# Altium schematic sheet Hardwiring.SchDoc
size 594 x 420 mm; Address1: Address1; Address2: Address2; Address3: Address3; Address4: Address4; DocumentNumber: *Э3; SheetNumber: 10; SheetTotal: 12; DocumentType: Схема электрическая *
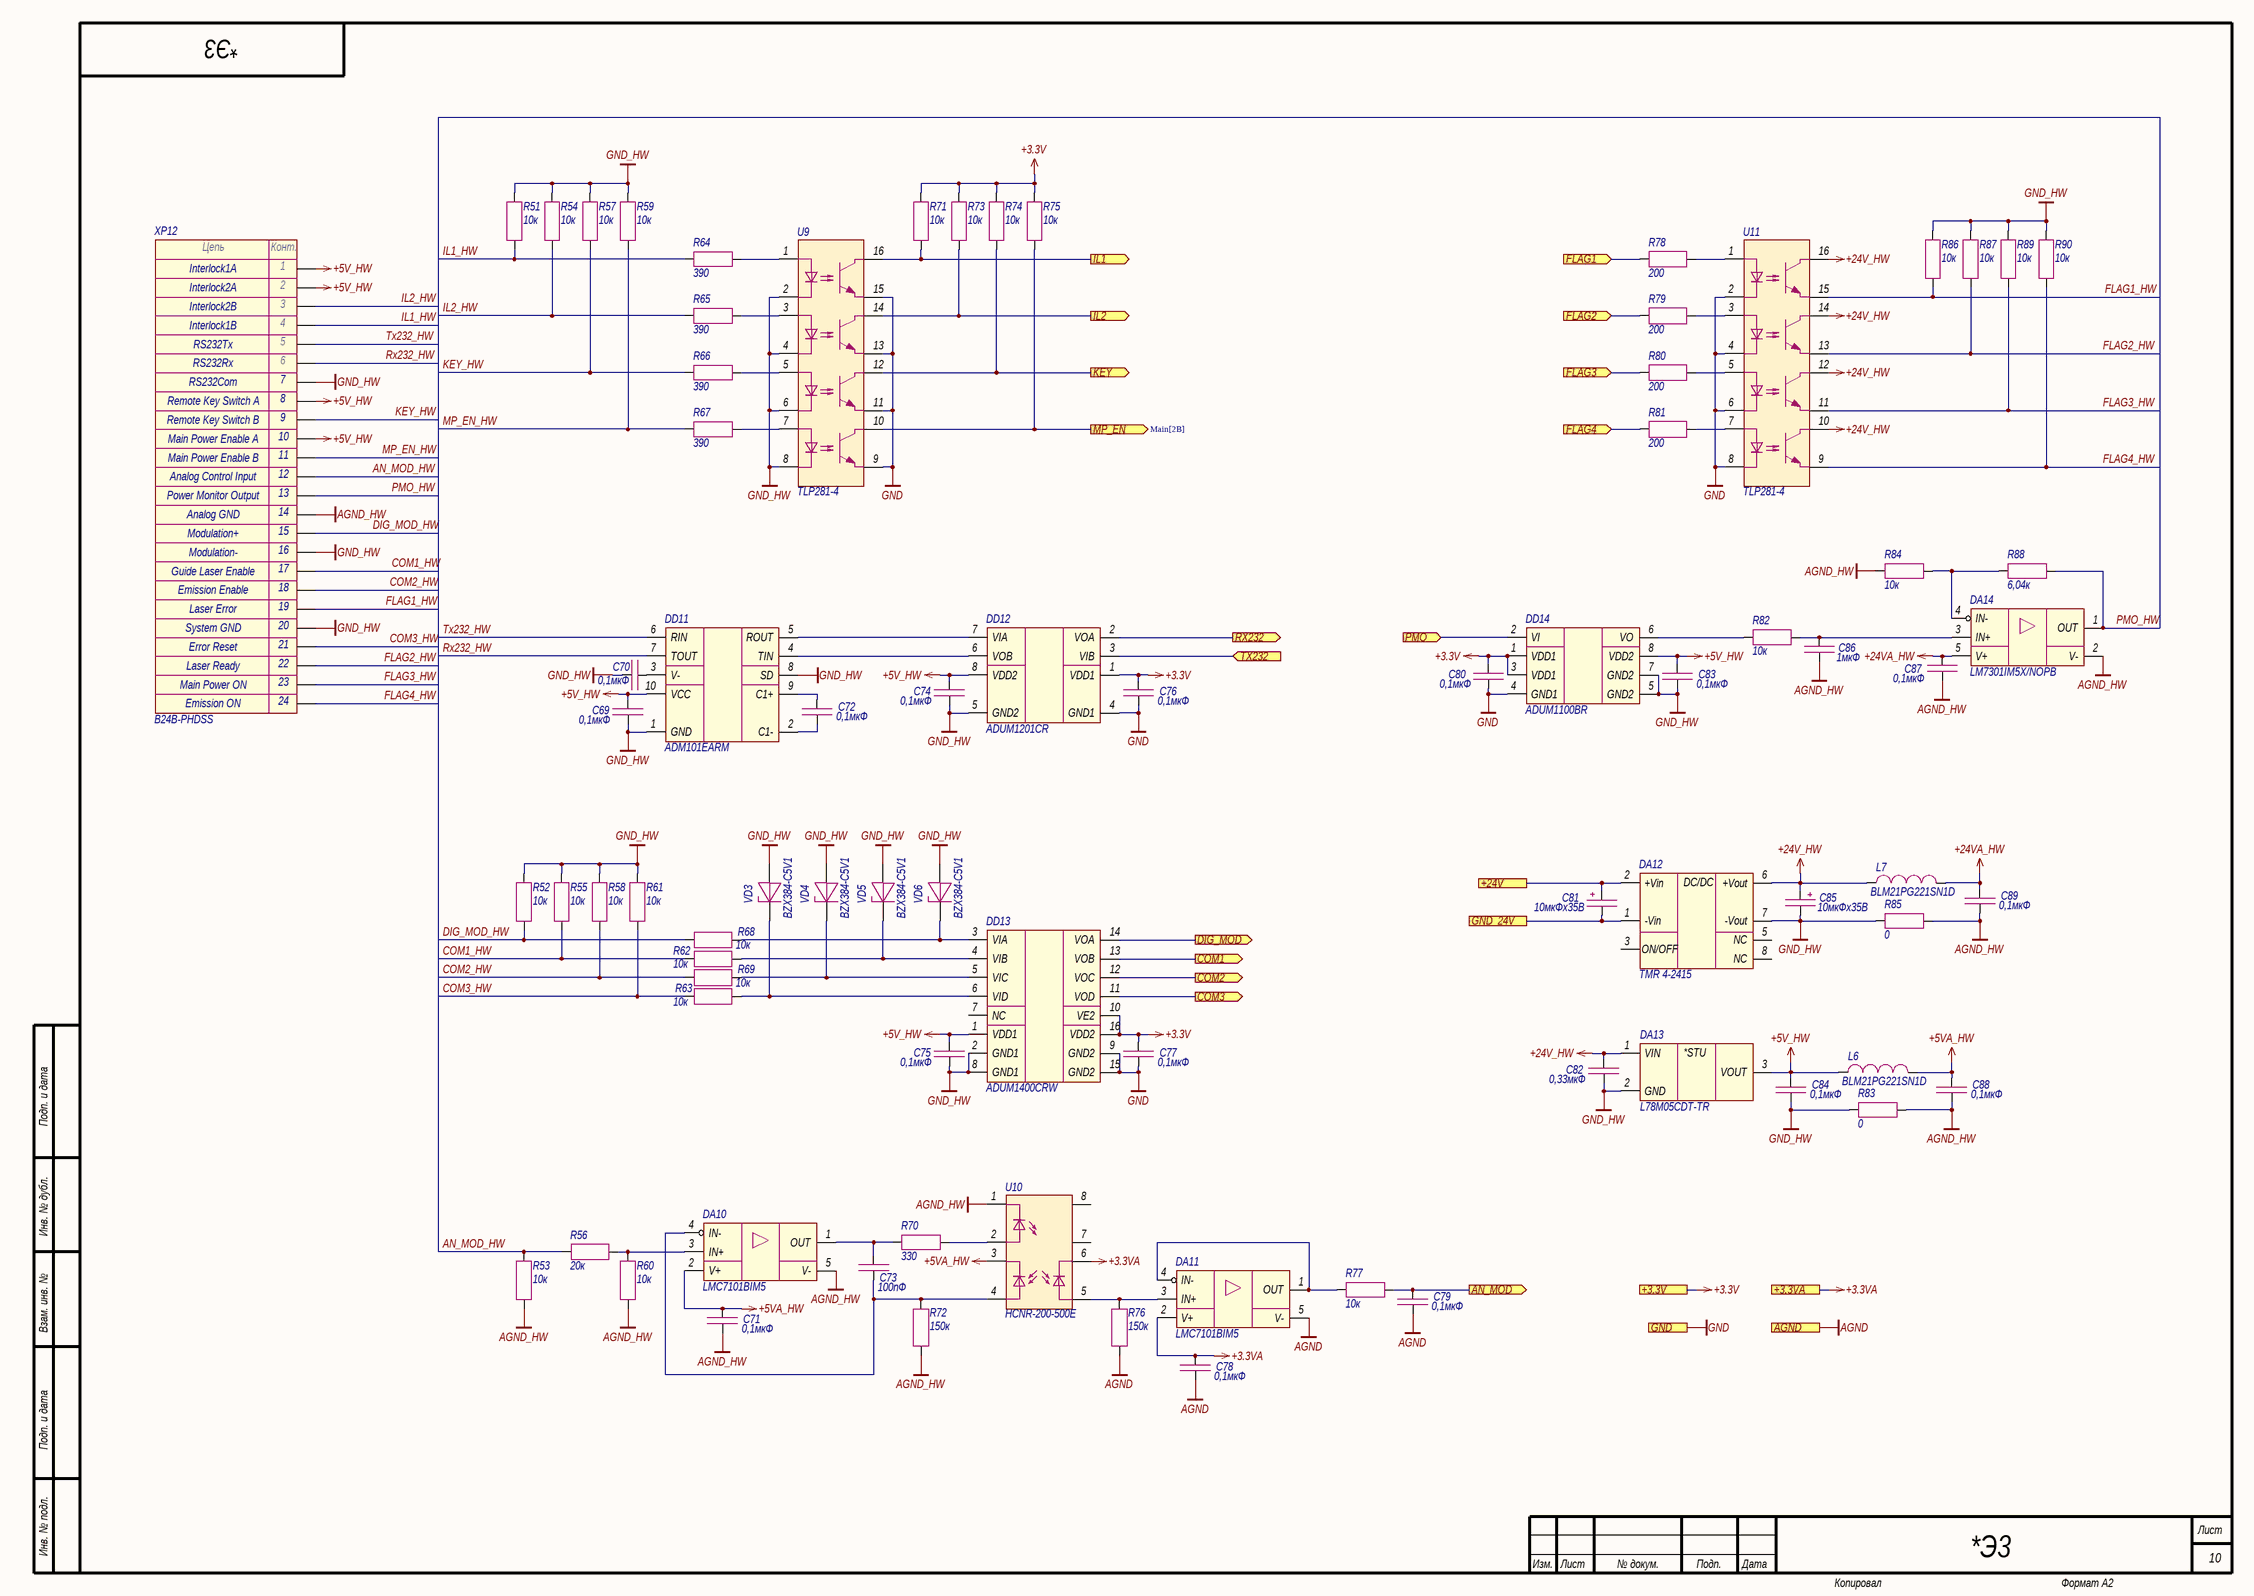
[diagram p0: Hardwiring.SchDoc]

## Parts
C69  0,1мкФ  [CAP_0603]
C70  0,1мкФ  [CAP_0603]
C71  0,1мкФ  [CAP_0603]
C72  0,1мкФ  [CAP_0603]
C73  100пФ  [CAP_0603]
C74  0,1мкФ  [CAP_0603]
C75  0,1мкФ  [CAP_0603]
C76  0,1мкФ  [CAP_0603]
C77  0,1мкФ  [CAP_0603]
C78  0,1мкФ  [CAP_0603]
C79  0,1мкФ  [CAP_0603]
C80  0,1мкФ  [CAP_0603]
C81  10мкФх35B  [CAP_C]
C82  0,33мкФ  [CAP_0805]
C83  0,1мкФ  [CAP_0603]
C84  0,1мкФ  [CAP_0603]
C85  10мкФх35B  [CAP_C]
C86  1мкФ  [CAP_0603]
C87  0,1мкФ  [CAP_0603]
C88  0,1мкФ  [CAP_0603]
C89  0,1мкФ  [CAP_0603]
DA10  LMC7101BIM5  [SOT-23-5]
DA11  LMC7101BIM5  [SOT-23-5]
DA12  TMR 4-2415  [TMR4 (SIP-8)]
DA13  L78M05CDT-TR  [TO-252]
DA14  LM7301IM5X/NOPB  [SOT-23-5]
DD11  ADM101EARM  [MSOP-10]
DD12  ADUM1201CR  [SOIC-8]
DD13  ADUM1400CRW  [SOIC-16W]
DD14  ADUM1100BR  [SOIC-8]
L6  BLM21PG221SN1D  [IND_0805]
L7  BLM21PG221SN1D  [IND_0805]
R51  10к  [RES_0603]
R52  10к  [RES_0603]
R53  10к  [RES_0603]
R54  10к  [RES_0603]
R55  10к  [RES_0603]
R56  20к  [RES_0603]
R57  10к  [RES_0603]
R58  10к  [RES_0603]
R59  10к  [RES_0603]
R60  10к  [RES_0603]
R61  10к  [RES_0603]
R62  10к  [RES_0603]
R63  10к  [RES_0603]
R64  390  [RES_0603]
R65  390  [RES_0603]
R66  390  [RES_0603]
R67  390  [RES_0603]
R68  10к  [RES_0603]
R69  10к  [RES_0603]
R70  330  [RES_0603]
R71  10к  [RES_0603]
R72  150к  [RES_0603]
R73  10к  [RES_0603]
R74  10к  [RES_0603]
R75  10к  [RES_0603]
R76  150к  [RES_0603]
R77  10к  [RES_0603]
R78  200  [RES_0603]
R79  200  [RES_0603]
R80  200  [RES_0603]
R81  200  [RES_0603]
R82  10к  [RES_0603]
R83  0  [RES_0805]
R84  10к  [RES_0603]
R85  0  [RES_0805]
R86  10к  [RES_0603]
R87  10к  [RES_0603]
R88  6,04к  [RES_0603]
R89  10к  [RES_0603]
R90  10к  [RES_0603]
U9  TLP281-4  [SOP-16]
U10  HCNR-200-500E  [HCNR200]
U11  TLP281-4  [SOP-16]
VD3  BZX384-C5V1  [SOD-323]
VD4  BZX384-C5V1  [SOD-323]
VD5  BZX384-C5V1  [SOD-323]
VD6  BZX384-C5V1  [SOD-323]
XP12  B24B-PHDSS  [B24B-PHDSS]

## Ports
+3.3V (see Main[3B], Bus[1D], Button[1D], Ethernet[3D], Fiber_interlock[2C], Flow_sensor[2C]), +3.3VA (see Main[3B], Thermistor[2C]), +24V (see Main[3B], Bus[1D], Button[1C], Column[1C], Flow_sensor[2C], Indication[1C]), AGND (see Main[3B], Photodiode[1C], Thermistor[2C]), AN_MOD (out, see Main[2B]), COM1 (out, see Main[2B]), COM2 (out, see Main[2B]), COM3 (out, see Main[2B]), DIG_MOD (out, see Main[2B]), FLAG1 (in, see Main[3B]), FLAG2 (in, see Main[3B]), FLAG3 (in, see Main[3B]), FLAG4 (in, see Main[3B]), GND (see Main[3B], Bus[1D], Button[1D], Column[1C], Ethernet[3D], Fiber_interlock[2C], Flow_sensor[2C], Guide_laser[1C], Indication[1C]), GND_24V (see Main[3C], Bus[1D], Button[1D], Column[1C], Flow_sensor[2C], Indication[1C]), IL1 (out, see Main[2B]), IL2 (out, see Main[2B]), KEY (out, see Main[2B]), MP_EN (out, see Main[2B]), PMO (in, see Main[3B]), RX232 (out, see Main[2B]), TX232 (in, see Main[2C])

## Nets
+3.3V: C76.1 C77.1 C80.1 DD12.1(VDD1) DD13.10(VE2) DD13.16(VDD2) DD14.1(VDD1) DD14.3(VDD1) R71.1 R73.1 R74.1 R75.1 ; port +3.3V
+3.3VA: C78.1 DA11.2(V+) U10.6 ; port +3.3VA
+5V_HW: C69.1 C74.1 C75.1 C83.1 C84.1 DA13.3(VOUT) DD11.10(VCC) DD12.8(VDD2) DD13.1(VDD1) DD14.8(VDD2) L6.1 XP12.1 XP12.2 XP12.8 XP12.10
+5VA_HW: C71.1 C88.1 DA10.2(V+) L6.2 U10.3
+24V_HW: C82.2 C85.1 DA12.6(+Vout) DA13.1(VIN) L7.1 U11.10 U11.12 U11.14 U11.16
+24VA_HW: C87.1 C89.1 DA14.5(V+) L7.2
AGND: C78.2 C79.2 DA11.5(V-) R76.2 ; port AGND
AGND_HW: C71.2 C86.2 C87.2 C88.2 C89.2 DA10.5(V-) DA14.2(V-) R53.2 R60.2 R72.2 R83.2 R84.1 R85.2 U10.1 XP12.14
GND: C76.2 C77.2 C80.2 DD12.4(GND1) DD13.9(GND2) DD13.15(GND2) DD14.4(GND1) U9.9 U9.11 U9.13 U9.15 U11.2 U11.4 U11.6 U11.8 ; port GND
GND_HW: C69.2 C70.2 C74.2 C75.2 C82.1 C83.2 C84.2 C85.2 DA12.7(-Vout) DA13.2(GND) DD11.1(GND) DD11.8(SD) DD12.5(GND2) DD13.2(GND1) DD13.8(GND1) DD14.5(GND2) DD14.7(GND2) R51.1 R52.1 R54.1 R55.1 R57.1 R58.1 R59.1 R61.1 R83.1 R85.1 R86.1 R87.1 R89.1 R90.1 U9.2 U9.4 U9.6 U9.8 VD3.2(A) VD4.2(A) VD5.2(A) VD6.2(A) XP12.7 XP12.16 XP12.20
+24V: C81.1 DA12.2(+Vin) ; port +24V
AN_MOD: C79.1 R77.2 ; port AN_MOD
AN_MOD_HW: R53.1 R56.1 XP12.12
COM1: DD13.13(VOB) ; port COM1
COM1_HW: R55.2 R62.1 XP12.17
COM2: DD13.12(VOC) ; port COM2
COM2_HW: R58.2 R69.1 XP12.18
COM3: DD13.11(VOD) ; port COM3
COM3_HW: R61.2 R63.1 XP12.21
DIG_MOD: DD13.14(VOA) ; port DIG_MOD
DIG_MOD_HW: R52.2 R68.1 XP12.15
FLAG1: R78.2 ; port FLAG1
FLAG1_HW: R86.2 U11.15 XP12.19
FLAG2: R79.2 ; port FLAG2
FLAG2_HW: R87.2 U11.13 XP12.22
FLAG3: R80.2 ; port FLAG3
FLAG3_HW: R89.2 U11.11 XP12.23
FLAG4: R81.2 ; port FLAG4
FLAG4_HW: R90.2 U11.9 XP12.24
GND_24V: C81.2 DA12.1(-Vin) ; port GND_24V
IL1: R71.2 U9.16 ; port IL1
IL1_HW: R51.2 R64.1 XP12.4
IL2: R73.2 U9.14 ; port IL2
IL2_HW: R54.2 R65.1 XP12.3
KEY: R74.2 U9.12 ; port KEY
KEY_HW: R57.2 R66.1 XP12.9
MP_EN: R75.2 U9.10 ; port MP_EN
MP_EN_HW: R59.2 R67.1 XP12.11
PMO: DD14.2(VI) ; port PMO
PMO_HW: DA14.1(OUT) R88.2 XP12.13
RX232: DD12.2(VOA) ; port RX232
Rx232_HW: DD11.7(TOUT) XP12.6
TX232: DD12.3(VIB) ; port TX232
Tx232_HW: DD11.6(RIN) XP12.5
NetC70_1: C70.1 DD11.3(V-)
NetC72_1: C72.1 DD11.9(C1+)
NetC72_2: C72.2 DD11.2(C1-)
NetC73_1: C73.1 DA10.1(OUT) R70.1
NetC73_2: C73.2 DA10.4(IN-) R72.1 U10.4
NetC86_1: C86.1 DA14.3(IN+) R82.2
NetDA10_3: DA10.3(IN+) R56.2 R60.1
NetDA11_1: DA11.1(OUT) DA11.4(IN-) R77.1
NetDA11_3: DA11.3(IN+) R76.1 U10.5
NetDA14_4: DA14.4(IN-) R84.2 R88.1
NetDD11_4: DD11.4(TIN) DD12.6(VOB)
NetDD11_5: DD11.5(ROUT) DD12.7(VIA)
NetDD13_3: DD13.3(VIA) R68.2 VD6.1(K)
NetDD13_4: DD13.4(VIB) R62.2 VD5.1(K)
NetDD13_5: DD13.5(VIC) R69.2 VD4.1(K)
NetDD13_6: DD13.6(VID) R63.2 VD3.1(K)
NetDD14_6: DD14.6(VO) R82.1
NetR64_2: R64.2 U9.1
NetR65_2: R65.2 U9.3
NetR66_2: R66.2 U9.5
NetR67_2: R67.2 U9.7
NetR70_2: R70.2 U10.2
NetR78_1: R78.1 U11.1
NetR79_1: R79.1 U11.3
NetR80_1: R80.1 U11.5
NetR81_1: R81.1 U11.7

Not connected (* = marked no-connect by the designer): DA12 3(ON/OFF) 5(NC) 8(NC); DD13 7(NC); U10 7 8

## Notes on the sheet
- Interlock1A
- Interlock2A
- Interlock2B
- Interlock1B
- RS232Tx
- RS232Rx
- RS232Com
- (near XP12) Remote Key Switch A
- (near XP12) Remote Key Switch B
- (near XP12) Main Power Enable A
- (near XP12) Main Power Enable B
- (near XP12) Analog Control Input
- (near XP12) Power Monitor Output
- Analog GND
- Modulation+
- Modulation-
- (near XP12) Guide Laser Enable
- (near XP12) Emission Enable
- System GND
- Error Reset
- Laser Error
- Main Power ON
- Emission ON
- Laser Ready
- Подп. и дата
- Инв. № дубл.
- Взам. инв. №
- Инв. № подл.
- Изм.
- Лист
- № докум.
- Подп.
- Дата
- Копировал
- Формат А2
- (in symbol Connector-24) Цепь; Конт.
- (in symbol L78M) *STU
- (in symbol TMR4) DC/DC

## Library data of the parts
C69-C72 C74-C80 C83 C84 C87-C89 = Capacitor: Manufacturer: Murata; Model: GRM188R71H104KA93D; Value: 0,1мкФ; Document: *
C73 = Capacitor: Manufacturer: Murata; Model: GRM1885C1H101JA01D; Value: 100пФ; Document: *
C81 C85 = Capacitor_Polar: Model: TECAP, 10 мкФ, 35 В, тип C, 10%; Value: 10мкФх35B; Document: *; Manufacturer: *
C82 = Capacitor: Manufacturer: Murata; Model: GRM219R71H334KA88D; Value: 0,33мкФ; Document: *
C86 = Capacitor: Manufacturer: Murata; Model: GRM188R61H105KAALD; Value: 1мкФ; Document: *
DA10 DA11 = LMC7101: Manufacturer: Texas Instruments; Model: LMC7101BIM5; Document: *
DA12 = TMR4: Manufacturer: Traco Power; Model: TMR 4-2415; Document: *
DA13 = L78M: Manufacturer: STMicroelectronics; Model: L78M05CDT-TR; Document: *
DA14 = LM7301IM5: Manufacturer: Texas Instruments; Model: LM7301IM5X/NOPB; Document: *
DD11 = ADM101EARM: Manufacturer: Analog Devices; Model: ADM101EARM; Document: *
DD12 = ADUM1201: Manufacturer: Analog Devices; Model: ADUM1201CR; Document: *
DD13 = ADUM1400: Manufacturer: Analog Devices; Model: ADUM1400CRW; Document: *
DD14 = ADUM1100: Manufacturer: Analog Devices; Model: ADUM1100BR; Document: *
L6 L7 = Inductor: Manufacturer: Murata; Value: *; Model: BLM21PG221SN1D; Document: *
R51-R55 R57-R63 R68 R69 R71 R73-R75 R77 R82 R84 R86 R87 R89 R90 = Resistor: Manufacturer: Yageo; Model: RC0603FR-0710KL; Value: 10к; Document: *
R56 = Resistor: Manufacturer: Yageo; Model: RC0603FR-0720KL; Value: 20к; Document: *
R64-R67 = Resistor: Manufacturer: Yageo; Model: RC0603FR-07390RL; Value: 390; Document: *
R70 = Resistor: Manufacturer: Yageo; Model: RC0603FR-07330RL; Value: 330; Document: *
R72 R76 = Resistor: Manufacturer: Yageo; Model: RC0603FR-07150KL; Value: 150к; Document: *
R78-R81 = Resistor: Manufacturer: Yageo; Model: RC0603FR-07200RL; Value: 200; Document: *
R83 R85 = Resistor: Manufacturer: Yageo; Model: RC0805FR-070RL; Value: 0; Document: *
R88 = Resistor: Manufacturer: Yageo; Model: RC0603FR-076K04L; Value: 6,04к; Document: *
U9 U11 = TLP281-4: Manufacturer: Toshiba; Model: TLP281-4; Document: *
U10 = HCNR200: Manufacturer: Avago; Model: HCNR-200-500E; Document: *
VD3-VD6 = Diode_Zener: Manufacturer: Nexperia; Model: BZX384-C5V1; Document: *
XP12 = Connector-24: Manufacturer: JST; Model: B24B-PHDSS; Document: *